# Altium schematic sheet BMS.SchDoc
size A; SheetNumber: 1
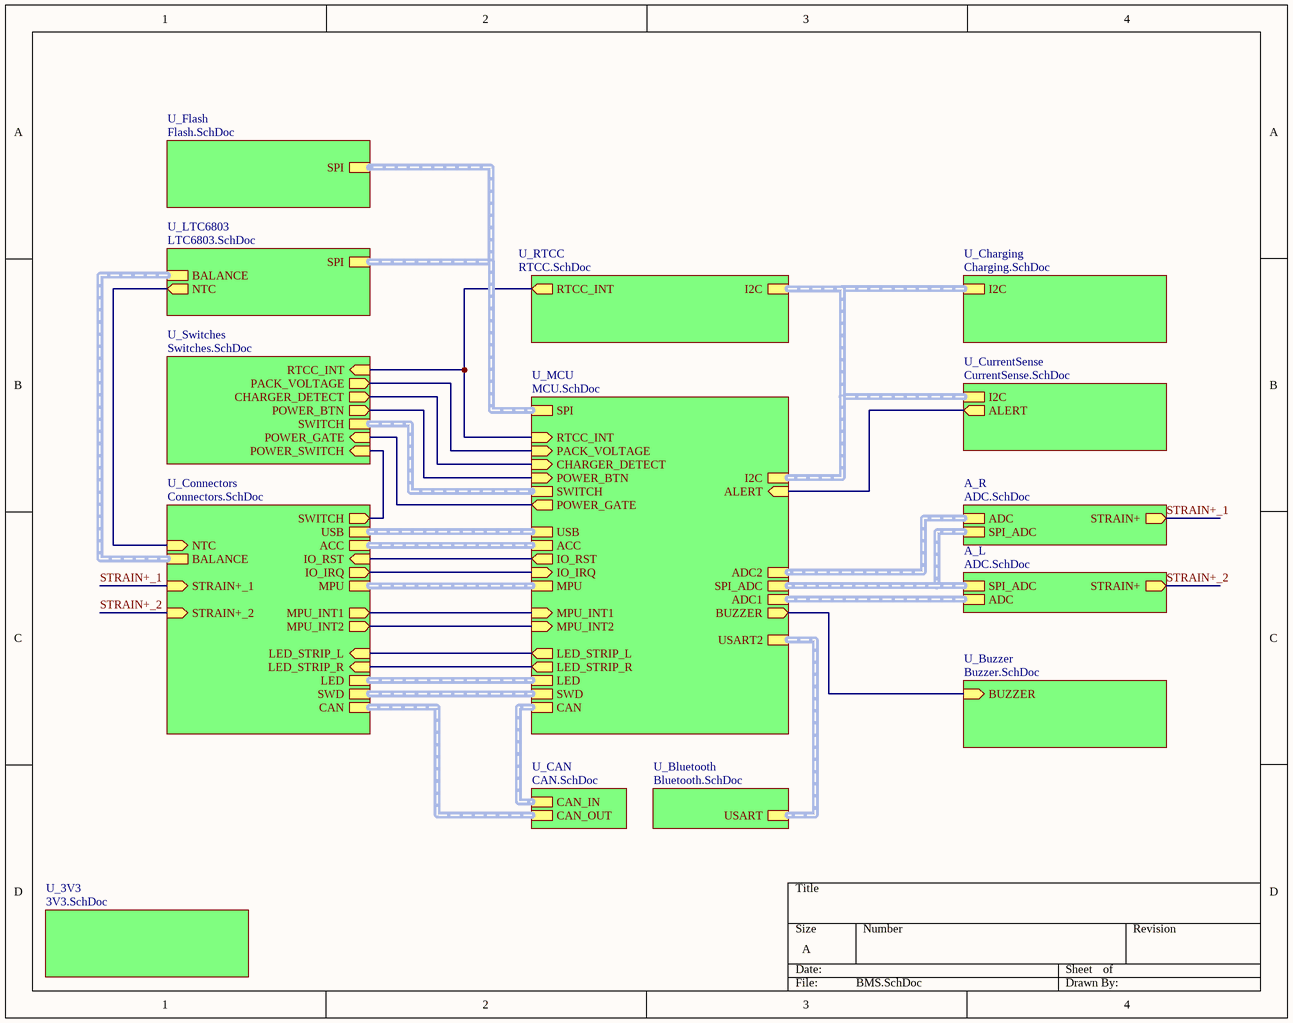
[diagram p0: BMS.SchDoc]

## Sub-sheets
A_L = ADC.SchDoc: SPI_ADC (harness SPI_ADC), ADC (harness ADC), STRAIN+ (out)
A_R = ADC.SchDoc: SPI_ADC (harness SPI_ADC), ADC (harness ADC), STRAIN+ (out)
U_3V3 = 3V3.SchDoc: no entries
U_Bluetooth = Bluetooth.SchDoc: USART (harness USART2)
U_Buzzer = Buzzer.SchDoc: BUZZER (in)
U_CAN = CAN.SchDoc: CAN_IN (harness CAN Input), CAN_OUT (harness CAN Output)
U_Charging = Charging.SchDoc: I2C (harness I2C)
U_Connectors = Connectors.SchDoc: USB (harness USB), ACC (harness Accessory Outputs), SWITCH (out), CAN (harness CAN Output), NTC (in), BALANCE (harness Balance), MPU (harness I2C), MPU_INT1 (out), MPU_INT2 (out), STRAIN+_1 (in), STRAIN+_2 (in), LED_STRIP_L (in), LED_STRIP_R (in), SWD (harness SWD), LED (harness LED), IO_RST (in), IO_IRQ (out)
U_CurrentSense = CurrentSense.SchDoc: ALERT (out), I2C (harness I2C)
U_Flash = Flash.SchDoc: SPI (harness SPI)
U_LTC6803 = LTC6803.SchDoc: SPI (harness SPI), NTC (out), BALANCE (harness Balance)
U_MCU = MCU.SchDoc: CHARGER_DETECT (in), POWER_BTN (in), POWER_GATE (out), USB (harness USB), CAN (harness CAN Input), ACC (harness Accessory Outputs), SWITCH (harness Switches), I2C (harness I2C), RTCC_INT (in), PACK_VOLTAGE (in), BUZZER (out), SPI_ADC (harness SPI_ADC), USART2 (harness USART2), ADC1 (harness ADC), ADC2 (harness ADC), MPU (harness I2C), MPU_INT1 (in), MPU_INT2 (in), ALERT (in), SPI, LED_STRIP_L (out), LED_STRIP_R (out), SWD (harness SWD), LED (harness LED), IO_RST (out), IO_IRQ (in)
U_RTCC = RTCC.SchDoc: I2C (harness I2C), RTCC_INT (out)
U_Switches = Switches.SchDoc: POWER_GATE (in), POWER_BTN (out), CHARGER_DETECT (out), SWITCH (harness Switches), POWER_SWITCH (in), RTCC_INT (in), PACK_VOLTAGE (out)

## Nets
STRAIN+_1: sheet U_Connectors/STRAIN+_1, sheet A_R/STRAIN+
STRAIN+_2: sheet U_Connectors/STRAIN+_2, sheet A_L/STRAIN+
(unnamed): sheet U_MCU/CHARGER_DETECT, sheet U_Switches/CHARGER_DETECT
(unnamed): sheet U_MCU/POWER_BTN, sheet U_Switches/POWER_BTN
(unnamed): sheet U_MCU/POWER_GATE, sheet U_Switches/POWER_GATE
(unnamed): sheet U_MCU/RTCC_INT, sheet U_Switches/RTCC_INT, sheet U_RTCC/RTCC_INT
(unnamed): sheet U_MCU/PACK_VOLTAGE, sheet U_Switches/PACK_VOLTAGE
(unnamed): sheet U_MCU/BUZZER, sheet U_Buzzer/BUZZER
(unnamed): sheet U_MCU/MPU_INT1, sheet U_Connectors/MPU_INT1
(unnamed): sheet U_MCU/MPU_INT2, sheet U_Connectors/MPU_INT2
(unnamed): sheet U_MCU/ALERT, sheet U_CurrentSense/ALERT
(unnamed): sheet U_MCU/LED_STRIP_L, sheet U_Connectors/LED_STRIP_L
(unnamed): sheet U_MCU/LED_STRIP_R, sheet U_Connectors/LED_STRIP_R
(unnamed): sheet U_MCU/IO_RST, sheet U_Connectors/IO_RST
(unnamed): sheet U_MCU/IO_IRQ, sheet U_Connectors/IO_IRQ
(unnamed): sheet U_Switches/POWER_SWITCH, sheet U_Connectors/SWITCH
(unnamed): sheet U_Connectors/NTC, sheet U_LTC6803/NTC

## Buses and harness runs
harness sheet A_L/ADC = sheet U_MCU/ADC1
harness sheet A_L/SPI_ADC = sheet A_R/SPI_ADC = sheet U_MCU/SPI_ADC
harness sheet A_R/ADC = sheet U_MCU/ADC2
harness sheet U_Bluetooth/USART = sheet U_MCU/USART2
harness sheet U_CAN/CAN_IN = sheet U_MCU/CAN
harness sheet U_CAN/CAN_OUT = sheet U_Connectors/CAN
harness sheet U_Charging/I2C = sheet U_CurrentSense/I2C = sheet U_MCU/I2C = sheet U_RTCC/I2C
harness sheet U_Connectors/ACC = sheet U_MCU/ACC
harness sheet U_Connectors/BALANCE = sheet U_LTC6803/BALANCE
harness sheet U_Connectors/LED = sheet U_MCU/LED
harness sheet U_Connectors/MPU = sheet U_MCU/MPU
harness sheet U_Connectors/SWD = sheet U_MCU/SWD
harness sheet U_Connectors/USB = sheet U_MCU/USB
harness sheet U_Flash/SPI = sheet U_LTC6803/SPI = sheet U_MCU/SPI
harness sheet U_MCU/SWITCH = sheet U_Switches/SWITCH